# Altium schematic sheet Motor.SchDoc
size A
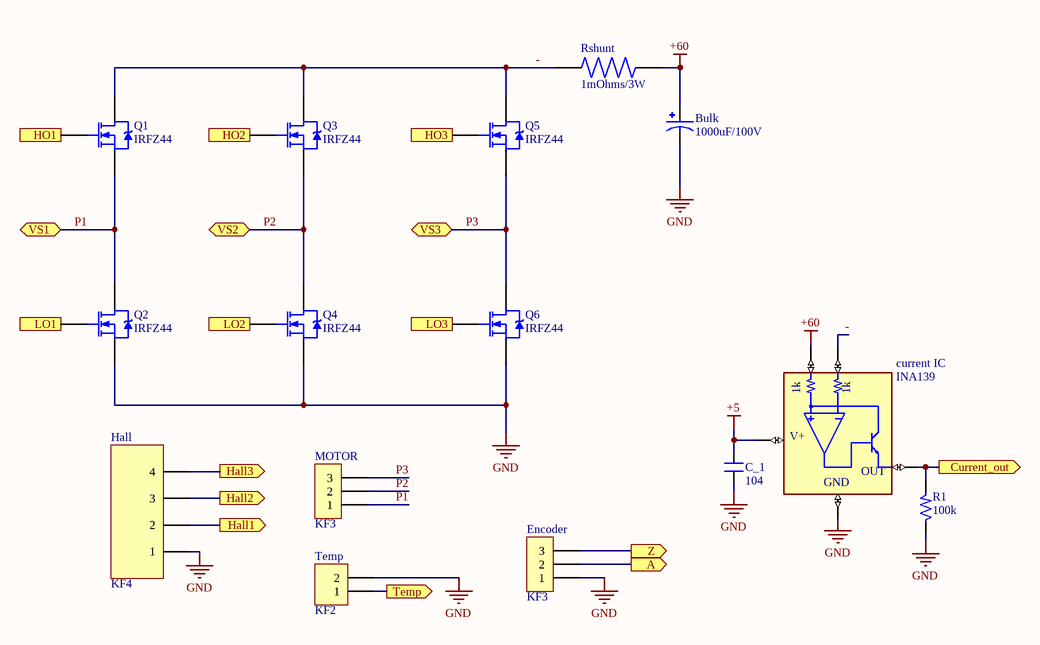
[diagram p0: Motor.SchDoc]

## Parts
Bulk  1000uF/100V  [CAPPRD750W80D1800H3550]
C_1  104  [CAP FILM 0603_1608]
current_IC  INA139  [MICROCHIP SOT-23-5 OT]
Encoder  KF3  [KF3-5.08]
Hall  KF4  [KF4-5.08]
MOTOR  KF3  [KF3-5.08]
Q1  IRFZ44  [DPAK508P1524X483-3N]
Q2  IRFZ44  [DPAK508P1524X483-3N]
Q3  IRFZ44  [DPAK508P1524X483-3N]
Q4  IRFZ44  [DPAK508P1524X483-3N]
Q5  IRFZ44  [DPAK508P1524X483-3N]
Q6  IRFZ44  [DPAK508P1524X483-3N]
R1  100k  [RES 0603_1608]
Rshunt  1mOhms/3W  [RESM11569X253N]
Temp  KF2  [KF2-5.08]

## Ports
A (out), Current_out (out), Hall1 (out), Hall2 (out), Hall3 (out), HO1 (in), HO2 (in), HO3 (in), LO1 (in), LO2 (in), LO3 (in), Temp (out), VS1 (bidir), VS2 (bidir), VS3 (bidir), Z (out)

## Nets
+5: C_1.1 current_IC.5(V+)
+60: Bulk.P current_IC.3(VIN+) Rshunt.2
GND: Bulk.N C_1.2 current_IC.2(GND) Encoder.1 Hall.1 Q2.3(S) Q4.3(S) Q6.3(S) R1.1 Temp.2
-: current_IC.4(VIN-) Q1.2(D) Q3.2(D) Q5.2(D) Rshunt.1
A: Encoder.2 ; port A
Current_out: current_IC.1(OUT) R1.2 ; port Current_out
Hall1: Hall.2 ; port Hall1
Hall2: Hall.3 ; port Hall2
Hall3: Hall.4 ; port Hall3
HO1: Q1.1(G) ; port HO1
HO2: Q3.1(G) ; port HO2
HO3: Q5.1(G) ; port HO3
LO1: Q2.1(G) ; port LO1
LO2: Q4.1(G) ; port LO2
LO3: Q6.1(G) ; port LO3
P1: MOTOR.1 Q1.3(S) Q2.2(D) ; port VS1
P2: MOTOR.2 Q3.3(S) Q4.2(D) ; port VS2
P3: MOTOR.3 Q5.3(S) Q6.2(D) ; port VS3
Temp: Temp.1 ; port Temp
Z: Encoder.3 ; port Z

## Notes on the sheet
- (in symbol INA139) 1k

## Library data of the parts
Bulk = ECA2AHG102E: Aluminum Electrolytic Capacitors, NHG-A Series, 1000uF +/- 20%, 100V, Radial lead type(18x35.5mm); MF: Panasonic; MP: ECA-2AHG102E; SnapEDA_Link: https://www.snapeda.com/parts/ECA-2AHG102E/Panasonic/view-part/6221685/?ref=snap; Availability: In Stock; Value: *; Check_prices: https://www.snapeda.com/parts/ECA-2AHG102E/Panasonic/view-part/6221685/?ref=eda; Package: RADIAL-2 Panasonic; Price: None
C_1 = CN: Value: 0,1uF/300V; Designed by: VanDungEvn
current_IC = INA139: Current Monitor Regulator High-Side SOT-23-5; MF: Texas Instruments; Package: SOT-23-5 Texas Instruments; Value: *; Availability: Unavailable; MP: INA139; SnapEDA_Link: https://www.snapeda.com/parts/INA139/Texas%20Instruments/view-part/560986/?ref=snap; Price: None
Encoder MOTOR = KF3: Manufacturer: Würth Elektronik eiSos GmbH; partNo: 691103110003; ComponentLink1 Description: Manufacturer; ComponentLink2 Description: Datasheet; NoPins: 3; Created Date: 29 October 2013; ComponentLink1URL: http://www.we-online.com; ComponentLink2URL: http://katalog.we-online.de/em/datasheet/6911031100xx.pdf; Created by: Karrer Zheng
Hall = KF4: Manufacturer: W¨¹rth Elektronik eiSos GmbH; PartNo: 691133710004; ComponentLink1 Description: Manufacturer; ComponentLink2 Description: Datasheet; NoPins: 4; ComponentLink1 URL: http://www.we-online.com; ComponentLink2 URL: http://katalog.we-online.de/em/datasheet/6911337100xx.pdf; Created By: Baojun Chen; Created Date: 4-Aug-15
Q1-Q6 = IRFZ44: HEXFET N-Channel Power MOSFET
R1 = R: Resistor 1/4W; Value: R1/4W - 1K
Rshunt = WSR31L000FEA: 3 mOhms Â±1% 5W Chip Resistor 4527 J-Lead Anti-Sulfur, Automotive AEC-Q200, Current Sense, Moisture Resistant, Pulse Withstanding Metal Element; Package: None; Price: None; Value: *; MP: WSR31L000FEA; Availability: Unavailable
Temp = KF2: Manufacturer: Würth Elektronik eiSos GmbH; partNo: 691103110002; ComponentLink1 Description: Manufacturer; ComponentLink2 Description: Datasheet; NoPins: 2; Created Date: 29 October 2013; ComponentLink1URL: http://www.we-online.com; ComponentLink2URL: http://katalog.we-online.de/em/datasheet/6911031100xx.pdf; Created by: Karrer Zheng